# EasyEDA schematic SCH_RE2-Y8950-REV.0.4_2024-09-22.json

## Sheets
1 Y8950: TITLE: Sheet_1; REV: 1.0; Date: 2023-12-22; Sheet: 1/1; Drawn By: Denjhang; Company: Your Company
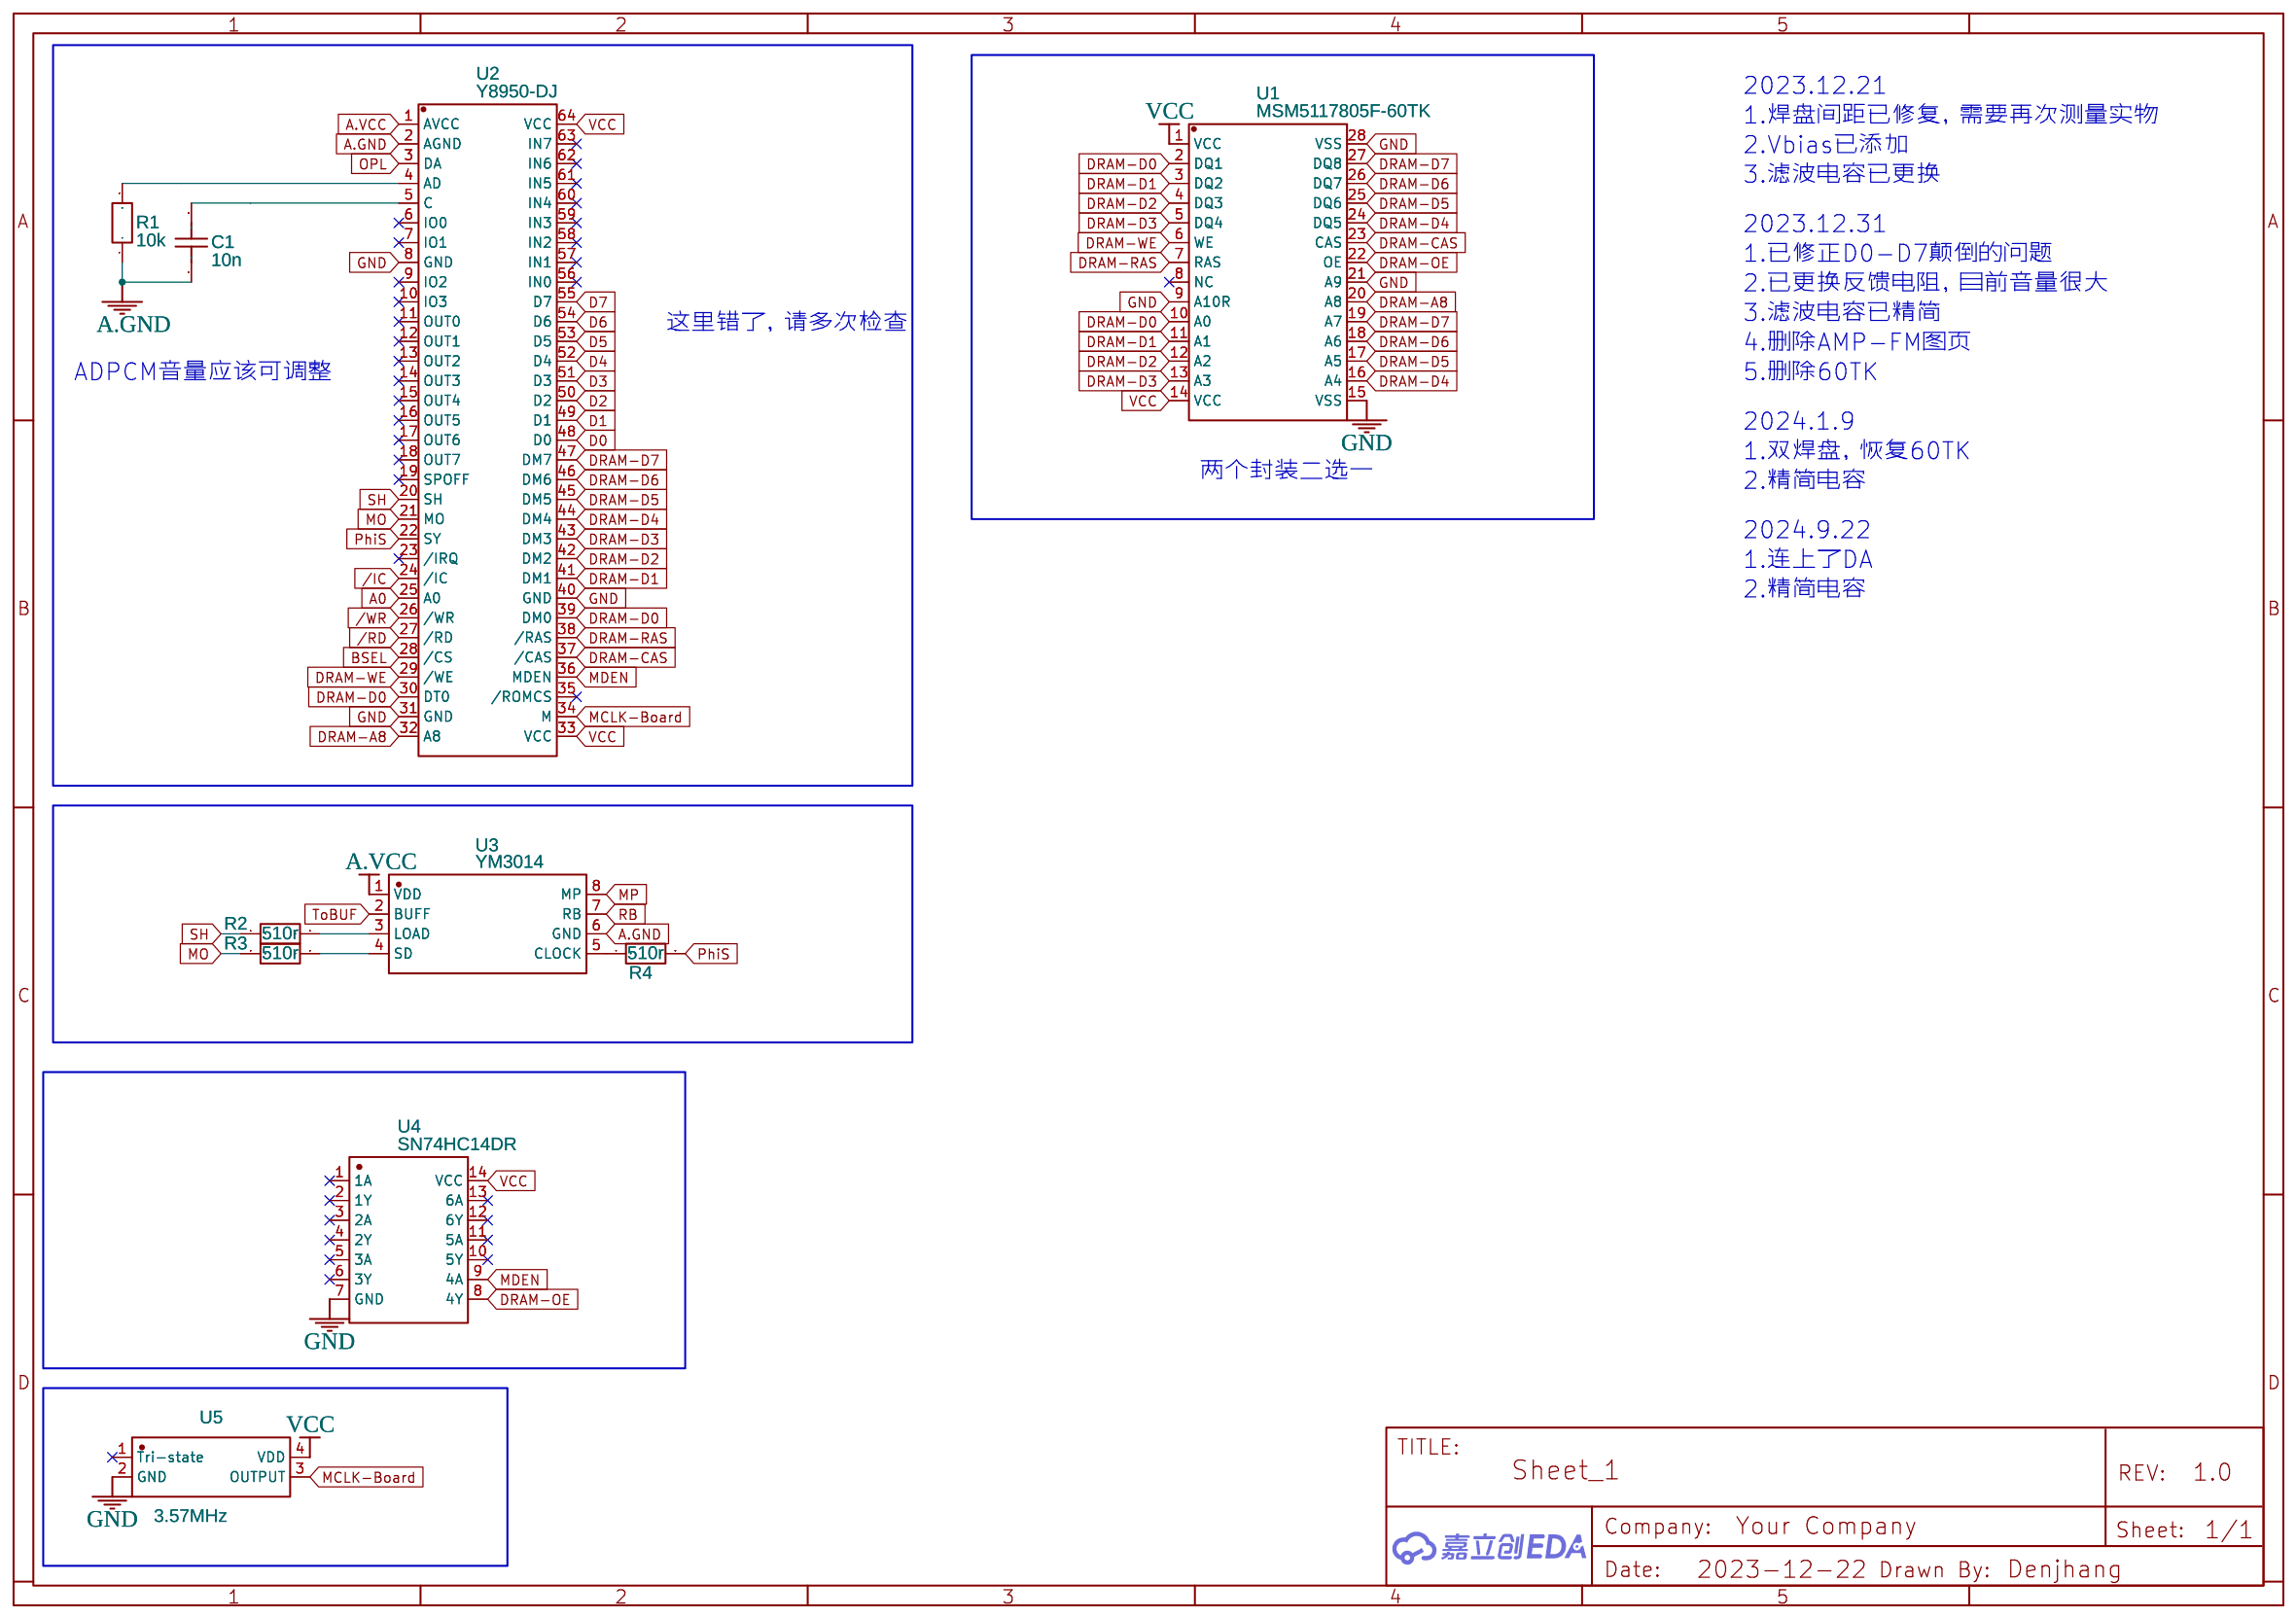
[diagram p0: Y8950]
2 DAC
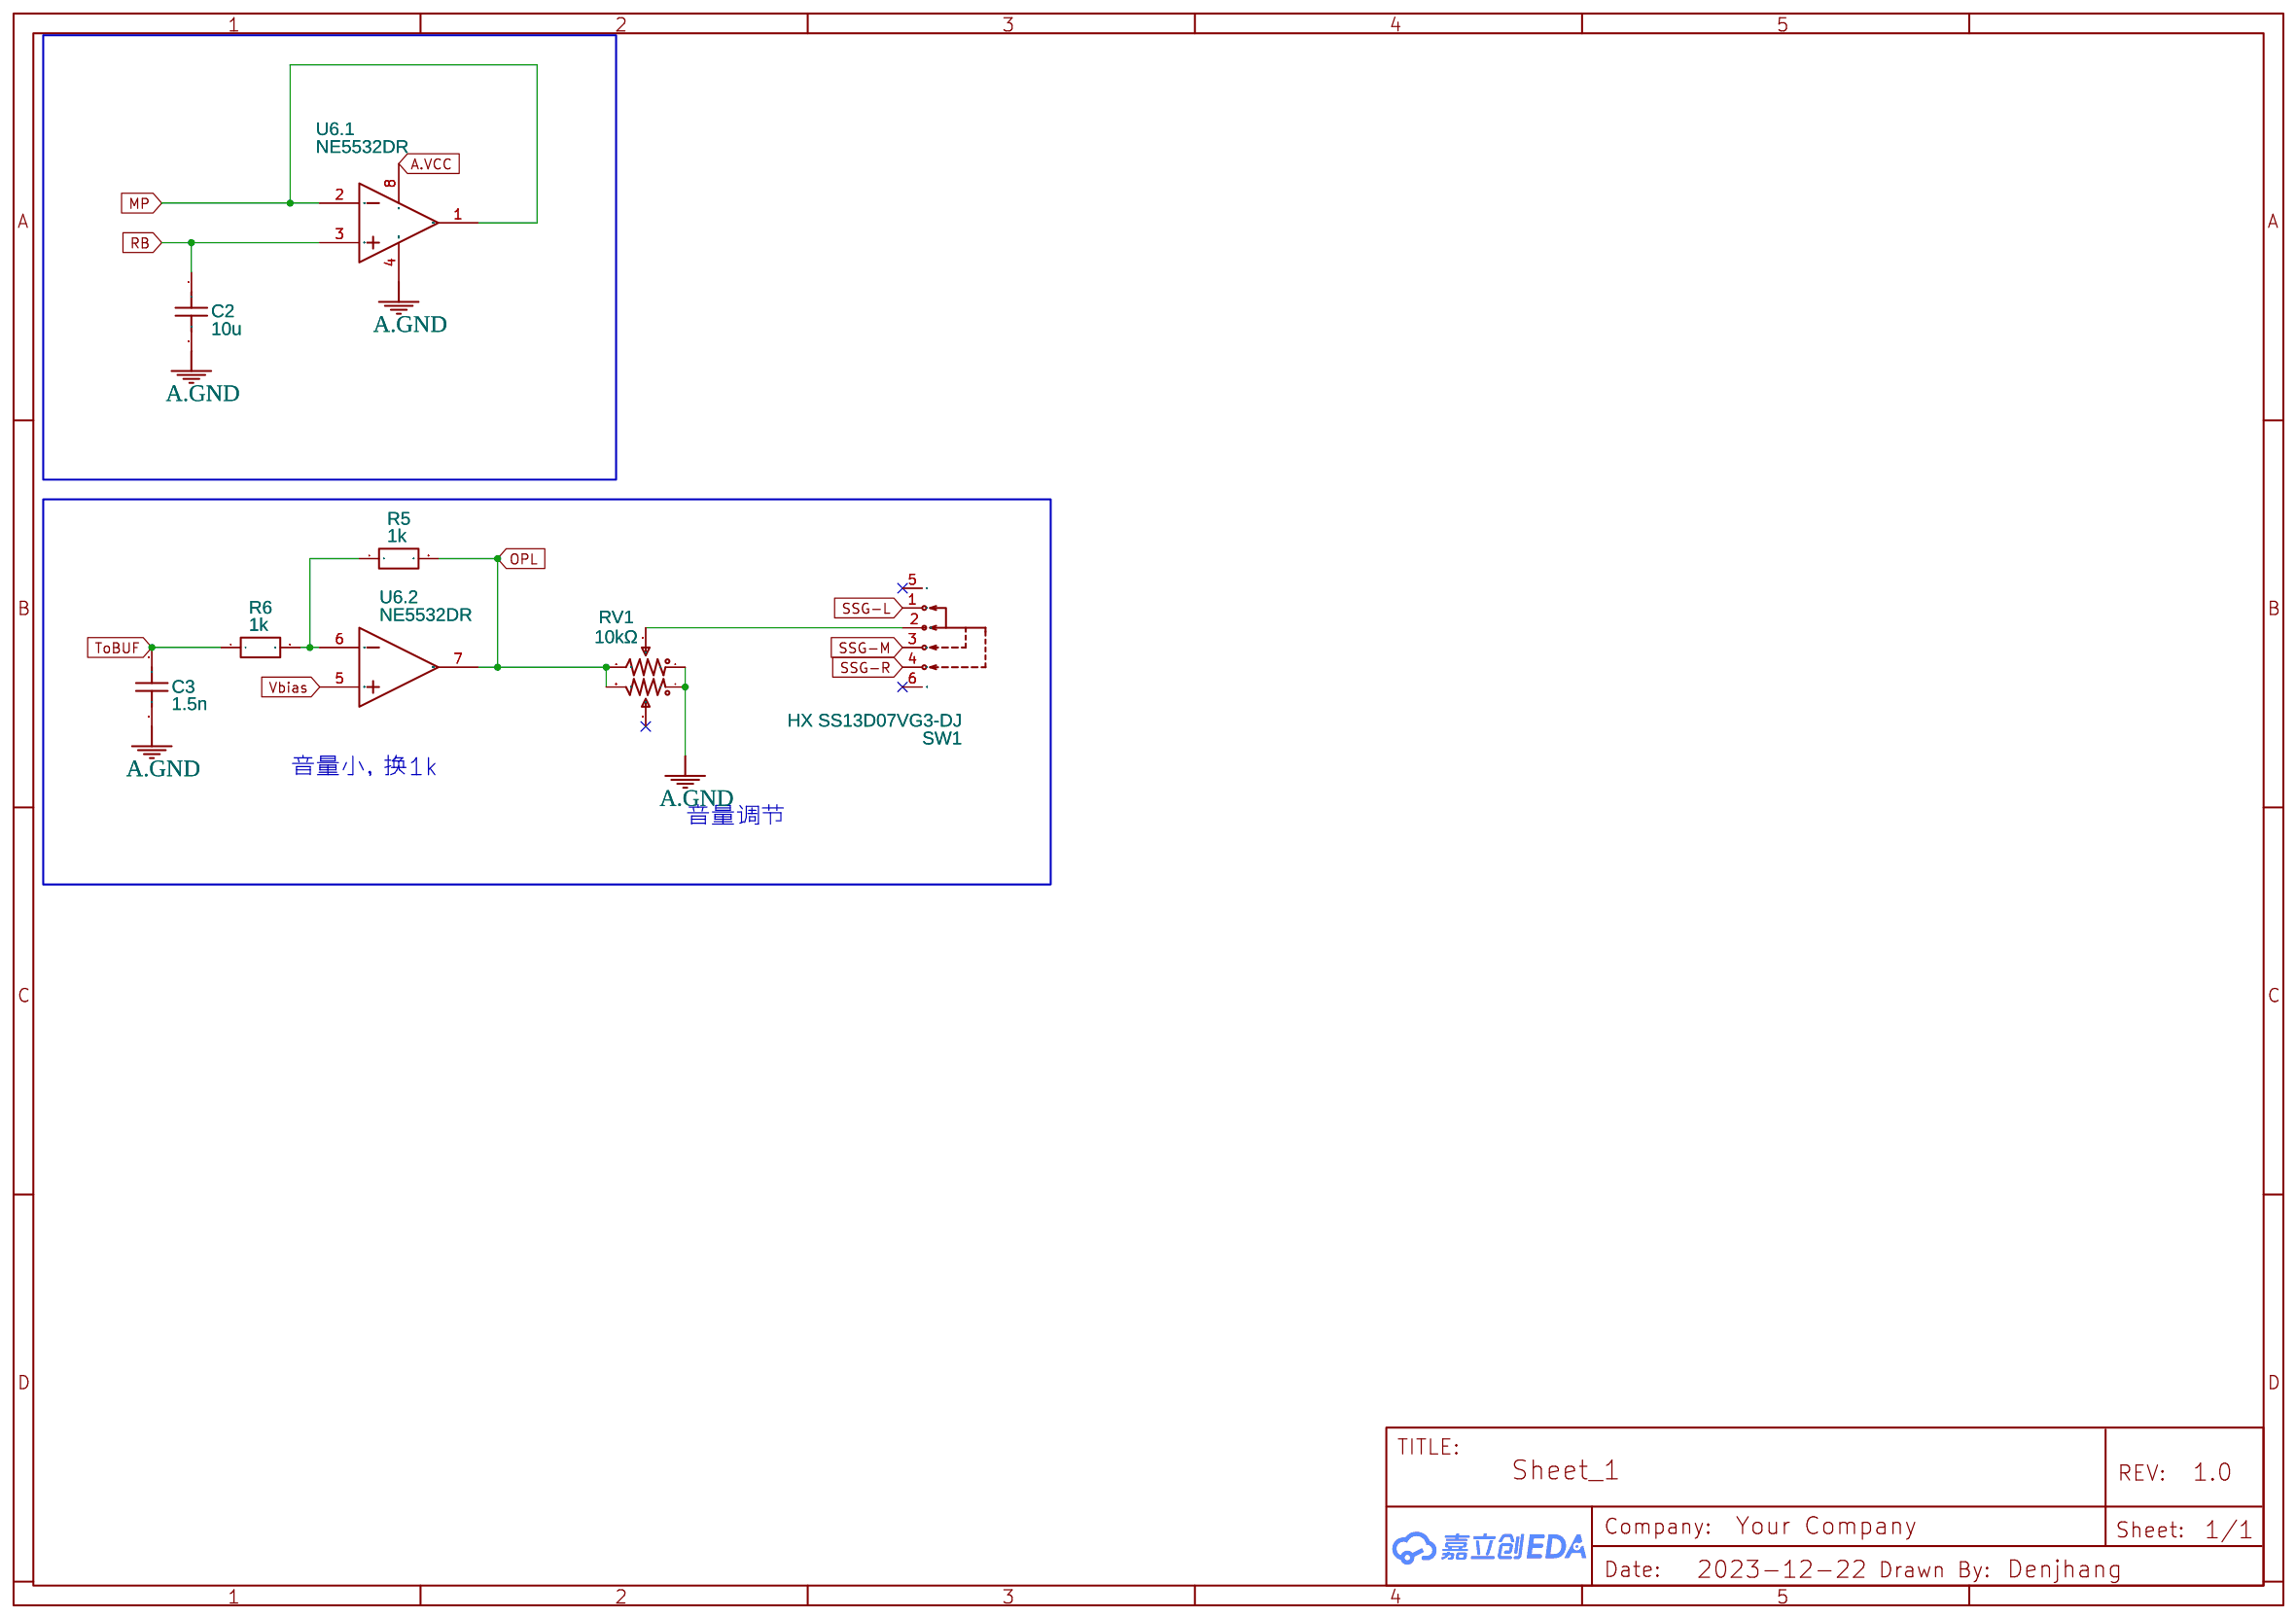
[diagram p1: DAC]
3 Mixer
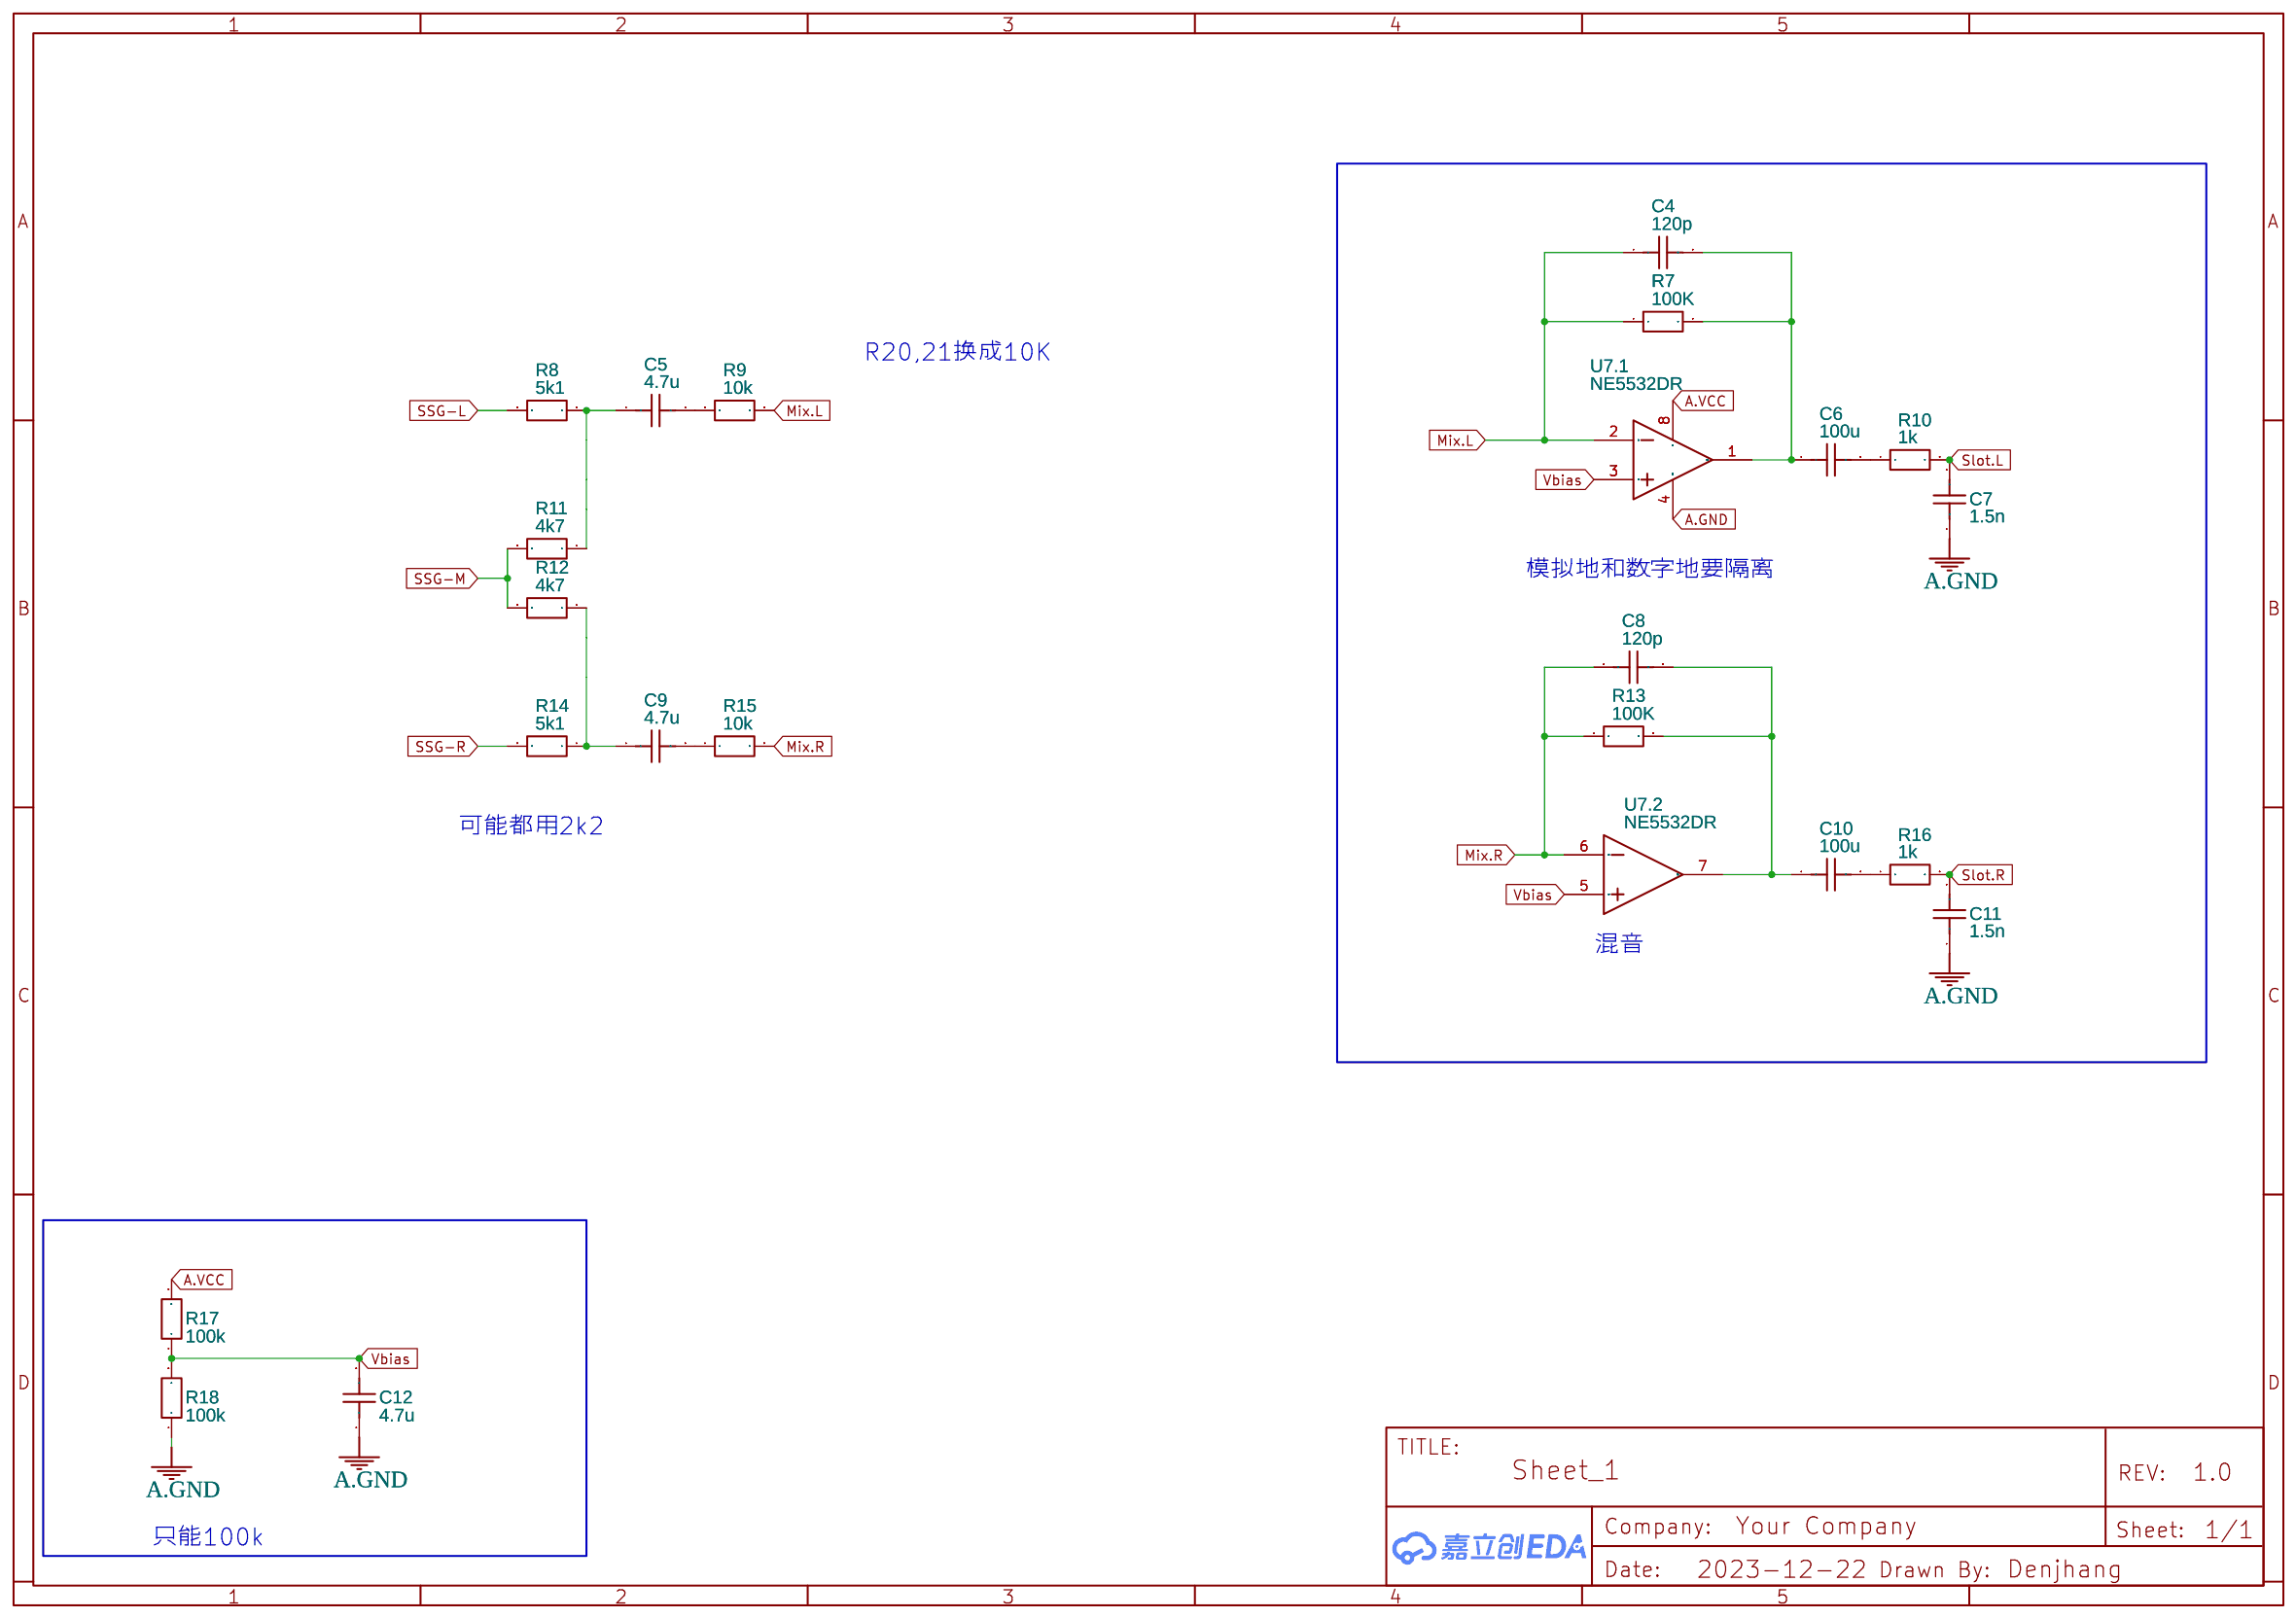
[diagram p2: Mixer]
4 BUS-PSU
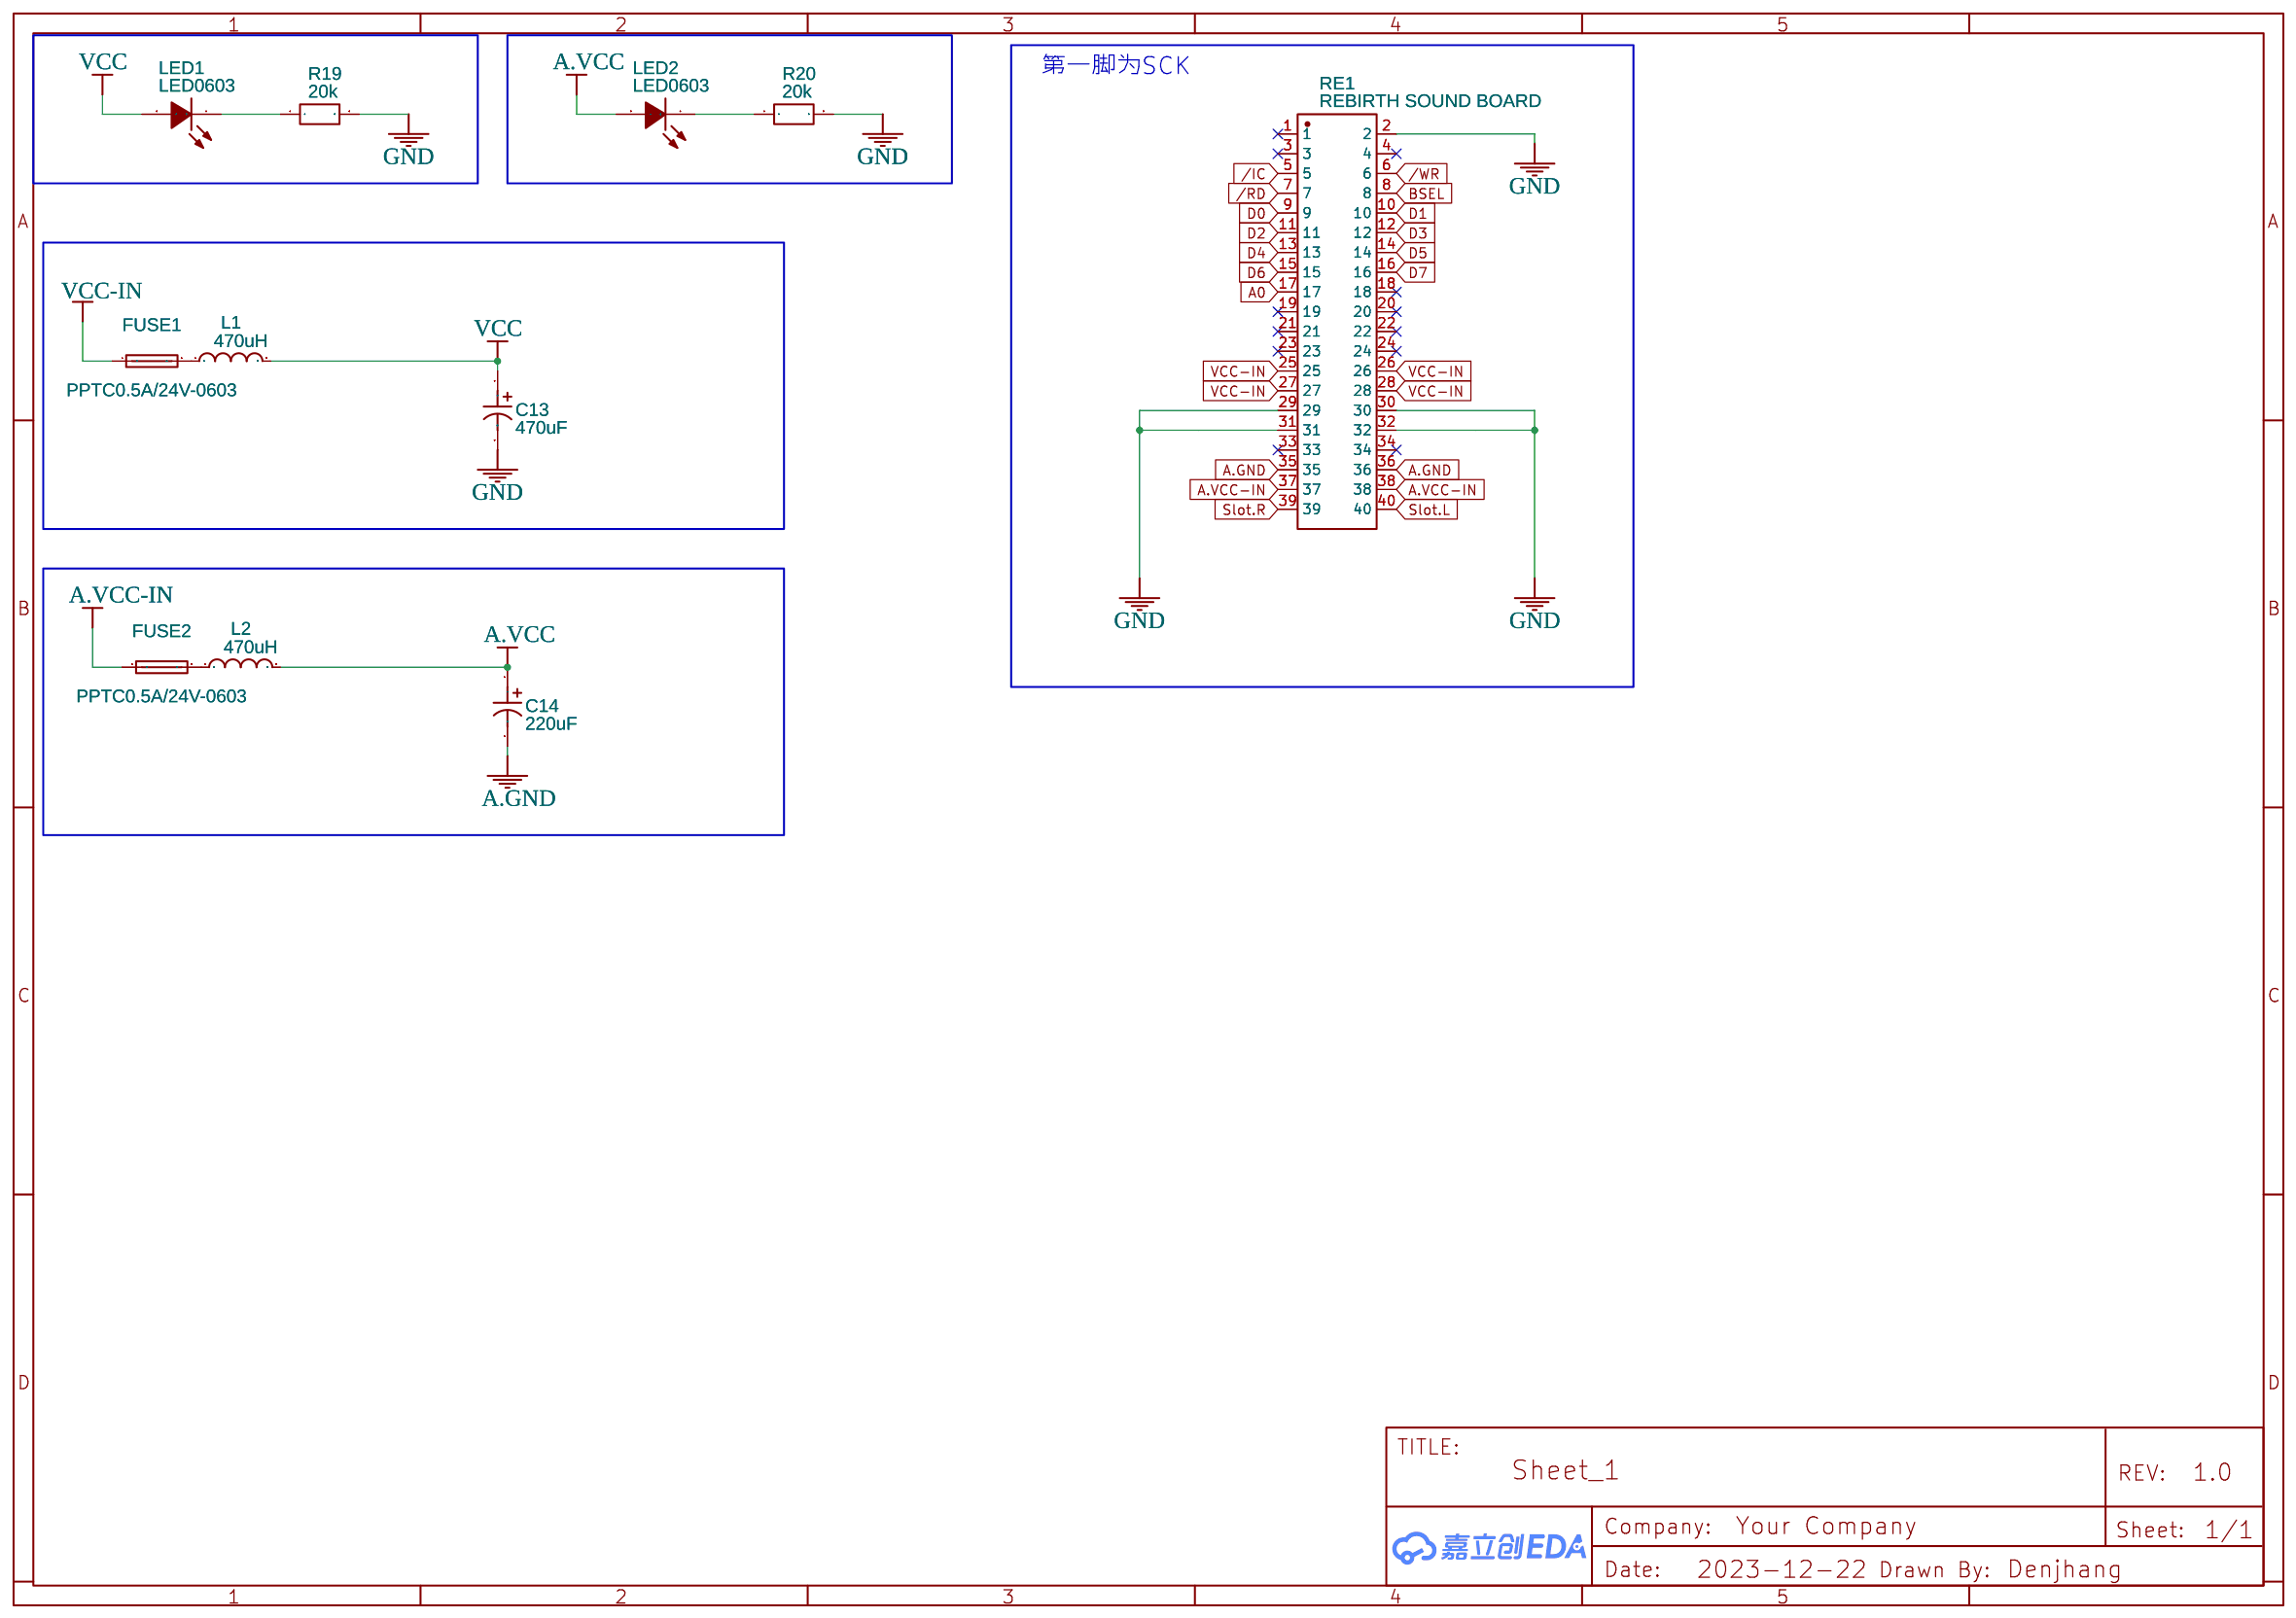
[diagram p3: BUS-PSU]

## Parts
sheet BUS-PSU
C13  470uF  [CAP-SMD_BD6.3-L6.6-W6.6-FD]
C14  220uF  [CAP-SMD_BD6.3-L6.6-W6.6-LS7.2-FD]
FUSE1  PPTC0.5A/24V-0603  [F0603]
FUSE2  PPTC0.5A/24V-0603  [F0603]
L1  470uH  [IND-SMD_L5.8-W5.2]
L2  470uH  [IND-SMD_L5.8-W5.2]
LED1  LED0603  [LED0603-RD]
LED2  LED0603  [LED0603-RD]
R19  20k  [R0603]
R20  20k  [R0603]
RE1  REBIRTH SOUND BOARD  [REBIRTH SOUND BOARD]
sheet DAC
C2  10u  [C0805]
C3  1.5n  [C0603]
R5  1k  [R0603]
R6  1k  [R0603]
RV1  10kΩ  [RK097G-DJ]
SW1  HX SS13D07VG3-DJ  [SW-TH_SS13D07VG4]
U6  NE5532DR  [SOIC-8_L4.9-W3.9-P1.27-LS6.0-BL]  (sections 1,2)
sheet Mixer
C4  120p  [C0603]
C5  4.7u  [C0603]
C6  100u  [C1206]
C7  1.5n  [C0603]
C8  120p  [C0603]
C9  4.7u  [C0603]
C10  100u  [C1206]
C11  1.5n  [C0603]
C12  4.7u  [C0603]
R7  100K  [R0603]
R8  5k1  [R0603]
R9  10k  [R0603]
R10  1k  [R0603]
R11  4k7  [R0603]
R12  4k7  [R0603]
R13  100K  [R0603]
R14  5k1  [R0603]
R15  10k  [R0603]
R16  1k  [R0603]
R17  100k  [R0603]
R18  100k  [R0603]
U7  NE5532DR  [SOIC-8_L4.9-W3.9-P1.27-LS6.0-BL]  (sections 1,2)
sheet Y8950
C1  10n  [C0603]
R1  10k  [R0603]
R2  510r  [R0603]
R3  510r  [R0603]
R4  510r  [R0603]
U1  MSM5117805F-60TK  [TSOP28-M5117805F-60TK]
U2  Y8950-DJ  [SDIP64-DJ]
U3  YM3014  [DIP-8-DJ]
U4  SN74HC14DR  [SOIC-14_L8.7-W3.9-P1.27-LS6.0-BL]
U5  3.57MHz  [OSC-SMD_4P-L3.2-W2.5-BL]

## Library data of the parts
C13 = RVT220UF16V67RV0015: Contributor: LCSC; Supplier: LCSC; Supplier Part: C2887273; Manufacturer: KNSCHA(科尼盛); JLCPCB Part Class: Extended Part; link: https://so.szlcsc.com/global.html?k=C2887273&ref=editor
C14 = RVT47UF35V67RV0039: Contributor: LCSC; Supplier: LCSC; Supplier Part: C2836440; Manufacturer: KNSCHA(科尼盛); JLCPCB Part Class: Extended Part; link: https://so.szlcsc.com/global.html?k=C2836440&ref=editor
FUSE1 FUSE2 = PPTC0.5A/24V-0603: Contributor: LCSC; Supplier: LCSC; Supplier Part: C9900007586; Manufacturer: null; Manufacturer Part: PPTC0.5A/24V 自恢复保险丝-0603; JLCPCB Part Class: Extended Part
L1 L2 = MSCD54-471KT: Contributor: LCSC; Supplier: LCSC; Supplier Part: C915206; Manufacturer: Meled(美莱); JLCPCB Part Class: Extended Part; link: https://so.szlcsc.com/global.html?k=C915206&ref=editor
LED1 LED2 = LED0603: Supplier: LCSC; Supplier Part: C2892154; Manufacturer: GBG; Manufacturer Part: GBG-C192KRKT; link: https://atta.szlcsc.comnull; Contributor: Denjhang
R1-R20 = R_0603_EU: Contributor: LCEDA_Lib
RE1 = REBIRTH SOUND BOARD: Contributor: lcsc; Supplier: LCSC; Supplier Part: C5242133; Manufacturer: XKB Connectivity(中国星坤); Manufacturer Part: X6522WR-2x20H-C60D30-E43F03
C2 = C_0805_US: Contributor: LCEDA_Lib
C1 C3-C5 C7-C9 C11 C12 = C_0603_US: Contributor: LCEDA_Lib
RV1 = RK097-双连体: Contributor: LCSC; Supplier: LCSC; Supplier Part: C231763; Manufacturer: ALPSALPINE(阿尔卑斯阿尔派); Manufacturer Part: RK09712200MY; JLCPCB Part Class: Extended Part
SW1 = HX SS13D07VG3-DJ: Supplier: LCSC; Supplier Part: C5149830; Manufacturer: hanxia(韩下); Manufacturer Part: HX SS13D07VG3; link: https://atta.szlcsc.com/upload/public/pdf/source/20220907/D3055C4464BFAA66BEB4549CABC5DD1D.pdf; Contributor: Denjhang
U6 U7 = NE5532DR: image: //image.lceda.cn/szlcsc/C7426.jpg; SMT Type: Basic; subpart_no: 2; Supplier: LCSC; Manufacturer: TI(德州仪器); LCSC Assembly: Yes; Supplier Part: C7426; JLCPCB Part Class: Basic Part
C6 C10 = C_1206_US: Contributor: LCEDA_Lib
U1 = MSM5117805F-60TK: Contributor: lizaer012
U2 = Y8950-DJ: Manufacturer Part: YAMAHA; Contributor: ZengRunMing
U3 = YM3014: Contributor: Denjhang
U4 = SN74HC14DR: Supplier: LCSC; Manufacturer: TI(德州仪器); Supplier Part: C6820; JLCPCB Part Class: Extended Part; link: https://so.szlcsc.com/global.html?k=C6820&ref=editor
U5 = OT32254MJBA4SL: Contributor: lcsc; Supplier: LCSC; Supplier Part: C2831397; Manufacturer: YXC(扬兴晶振); JLCPCB Part Class: Extended Part; link: https://so.szlcsc.com/global.html?k=C2831397&ref=editor

## Nets
GND: C13.2 R19.2 R20.2 RE1.2 RE1.29 RE1.30 RE1.31 RE1.32 U1.9(A10R) U1.15(VSS) U1.21(A9) U1.28(VSS) U2.8(GND) U2.31(GND) U2.40(GND) U4.7(GND) U5.2(GND)
VCC: C13.1 L1.2 LED1.2(A) U1.1(VCC) U1.14(VCC) U2.33(VCC) U2.64(VCC) U4.14(VCC) U5.4(VDD)
VCC-IN: FUSE1.1 RE1.25 RE1.26 RE1.27 RE1.28
/IC: RE1.5 U2.24(/IC)
/RD: RE1.7 U2.27(/RD)
/WR: RE1.6 U2.26(/WR)
A0: RE1.17 U2.25(A0)
A.GND: C1.1 C2.2 C3.1 C7.1 C11.1 C12.1 C14.2 R1.1 R18.1 RE1.35 RE1.36 RV1.1 RV1.4 U2.2(AGND) U3.6(GND) U6.4(VCC-/GND) U7.4(VCC-/GND)
A.VCC: C14.1 L2.2 LED2.2(A) R17.2 U2.1(AVCC) U3.1(VDD) U6.8(VCC+) U7.8(VCC+)
A.VCC-IN: FUSE2.1 RE1.37 RE1.38
BSEL: RE1.8 U2.28(/CS)
D0: RE1.9 U2.48(D0)
D1: RE1.10 U2.49(D1)
D2: RE1.11 U2.50(D2)
D3: RE1.12 U2.51(D3)
D4: RE1.13 U2.52(D4)
D5: RE1.14 U2.53(D5)
D6: RE1.15 U2.54(D6)
D7: RE1.16 U2.55(D7)
DRAM-A8: U1.20(A8) U2.32(A8)
DRAM-CAS: U1.23(CAS) U2.37(/CAS)
DRAM-D0: U1.2(DQ1) U1.10(A0) U2.30(DT0) U2.39(DM0)
DRAM-D1: U1.3(DQ2) U1.11(A1) U2.41(DM1)
DRAM-D2: U1.4(DQ3) U1.12(A2) U2.42(DM2)
DRAM-D3: U1.5(DQ4) U1.13(A3) U2.43(DM3)
DRAM-D4: U1.16(A4) U1.24(DQ5) U2.44(DM4)
DRAM-D5: U1.17(A5) U1.25(DQ6) U2.45(DM5)
DRAM-D6: U1.18(A6) U1.26(DQ7) U2.46(DM6)
DRAM-D7: U1.19(A7) U1.27(DQ8) U2.47(DM7)
DRAM-OE: U1.22(OE) U4.8(4Y)
DRAM-RAS: U1.7(RAS) U2.38(/RAS)
DRAM-WE: U1.6(WE) U2.29(/WE)
MCLK-Board: U2.34(M) U5.3(OUTPUT)
MDEN: U2.36(MDEN) U4.9(4A)
Mix.L: C4.1 R7.1 R9.2 U7.2(IN1-)
Mix.R: C8.1 R13.1 R15.2 U7.6(IN2-)
MO: R3.1 U2.21(MO)
MP: U3.8(MP) U6.1(OUT1) U6.2(IN1-)
OPL: R5.2 RV1.3 RV1.6 U2.3(DA) U6.7(OUT2)
PhiS: R4.2 U2.22(SY)
RB: C2.1 U3.7(RB) U6.3(IN1+)
SH: R2.1 U2.20(SH)
Slot.L: C7.2 R10.2 RE1.40
Slot.R: C11.2 R16.2 RE1.39
SSG-L: R8.2 SW1.1
SSG-M: R11.2 R12.2 SW1.3
SSG-R: R14.2 SW1.4
ToBUF: C3.2 R6.1 U3.2(BUFF)
Vbias: C12.2 R17.1 R18.2 U6.5(IN2+) U7.3(IN1+) U7.5(IN2+)
Net-(C1-2): C1.2 U2.5(C)
Net-(C4-2): C4.2 C6.1 R7.2 U7.1(OUT1)
Net-(C5-1): C5.1 R8.1 R11.1
Net-(C5-2): C5.2 R9.1
Net-(C6-2): C6.2 R10.1
Net-(C8-2): C8.2 C10.1 R13.2 U7.7(OUT2)
Net-(C9-1): C9.1 R12.1 R14.1
Net-(C9-2): C9.2 R15.1
Net-(C10-2): C10.2 R16.1
Net-(FUSE1-2): FUSE1.2 L1.1
Net-(FUSE2-2): FUSE2.2 L2.1
Net-(LED1-1): LED1.1(C) R19.1
Net-(LED2-1): LED2.1(C) R20.1
Net-(R1-2): R1.2 U2.4(AD)
Net-(R2-2): R2.2 U3.3(LOAD)
Net-(R3-2): R3.2 U3.4(SD)
Net-(R4-1): R4.1 U3.5(CLOCK)
Net-(R5-1): R5.1 R6.2 U6.6(IN2-)
Net-(RV1-2): RV1.2 SW1.2

Not connected (* = marked no-connect by the designer): RE1 1* 3* 4* 18* 19* 20* 21* 22* 23* 24* 33* 34*; RV1 5*; SW1 5* 6*; U1 8(NC)*; U2 6(IO0)* 7(IO1)* 9(IO2)* 10(IO3)* 11(OUT0)* 12(OUT1)* 13(OUT2)* 14(OUT3)* 15(OUT4)* 16(OUT5)* 17(OUT6)* 18(OUT7)* 19(SPOFF)* 23(/IRQ)* 35(/ROMCS)* 56(IN0)* 57(IN1)* 58(IN2)* 59(IN3)* 60(IN4)* 61(IN5)* 62(IN6)* 63(IN7)*; U4 1(1A)* 2(1Y)* 3(2A)* 4(2Y)* 5(3A)* 6(3Y)* 10(5Y)* 11(5A)* 12(6Y)* 13(6A)*; U5 1(Tri-state)*

## Notes on the sheets
sheet 1
- 2023.12.21
- 1.焊盘间距已修复，需要再次测量实物
- 2.Vbias已添加
- 3.滤波电容已更换
- 2023.12.31
- 1.已修正D0-D7颠倒的问题
- 2.已更换反馈电阻，目前音量很大
- 3.滤波电容已精简
- 这里错了，请多次检查
- 4.删除AMP-FM图页
- ADPCM音量应该可调整
- 5.删除60TK
- 2024.1.9
- 1.双焊盘，恢复60TK
- 两个封装二选一
- 2.精简电容
- 2024.9.22
- 1.连上了DA
- 2.精简电容
sheet 2
- 音量小，换1k
- 音量调节
sheet 3
- R20,21换成10K
- 模拟地和数字地要隔离
- 可能都用2k2
- 混音
- 只能100k
sheet 4
- 第一脚为SCK
